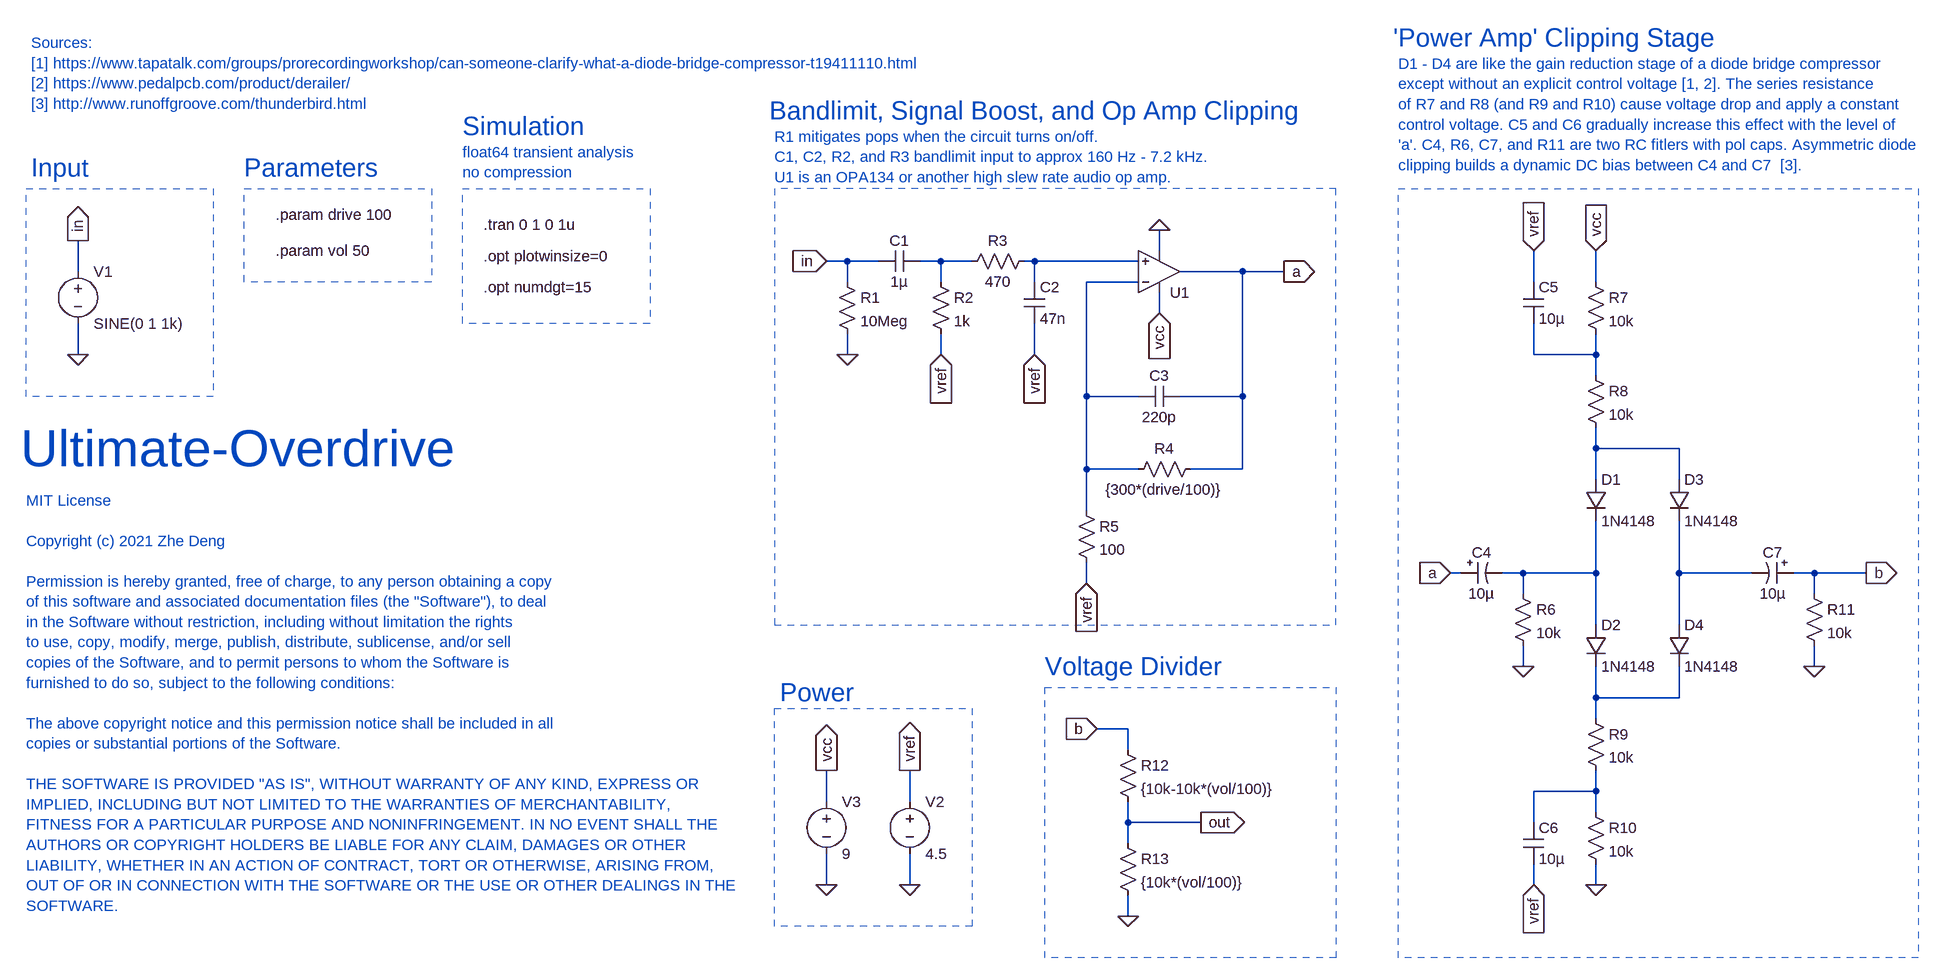
[diagram p0: schematic Ultimate-Overdrive.asc]
Ultimate-Overdrive.asc, the LTspice schematic file:
Version 4
SHEET 1 149556 120332
WIRE -427376 -275488 -427376 -275520
WIRE -427856 -275472 -427888 -275472
WIRE -427808 -275472 -427856 -275472
WIRE -427712 -275472 -427744 -275472
WIRE -427664 -275472 -427712 -275472
WIRE -427568 -275472 -427584 -275472
WIRE -427408 -275472 -427568 -275472
WIRE -429040 -275456 -429040 -275504
WIRE -427248 -275456 -427344 -275456
WIRE -427184 -275456 -427248 -275456
WIRE -427856 -275440 -427856 -275472
WIRE -427712 -275440 -427712 -275472
WIRE -427568 -275440 -427568 -275472
WIRE -427408 -275440 -427488 -275440
WIRE -426800 -275440 -426800 -275488
WIRE -426704 -275440 -426704 -275488
WIRE -427376 -275392 -427376 -275424
WIRE -429040 -275328 -429040 -275376
WIRE -427856 -275328 -427856 -275360
WIRE -427712 -275328 -427712 -275360
WIRE -427568 -275328 -427568 -275376
WIRE -426800 -275328 -426800 -275376
WIRE -426704 -275328 -426704 -275360
WIRE -426704 -275328 -426800 -275328
WIRE -426704 -275296 -426704 -275328
WIRE -427488 -275264 -427488 -275440
WIRE -427408 -275264 -427488 -275264
WIRE -427248 -275264 -427248 -275456
WIRE -427248 -275264 -427344 -275264
WIRE -426704 -275184 -426704 -275216
WIRE -426576 -275184 -426704 -275184
WIRE -427488 -275152 -427488 -275264
WIRE -427408 -275152 -427488 -275152
WIRE -427248 -275152 -427248 -275264
WIRE -427248 -275152 -427328 -275152
WIRE -426704 -275136 -426704 -275184
WIRE -426576 -275136 -426576 -275184
WIRE -427488 -275088 -427488 -275152
WIRE -426912 -274992 -426928 -274992
WIRE -426816 -274992 -426848 -274992
WIRE -426704 -274992 -426704 -275072
WIRE -426704 -274992 -426816 -274992
WIRE -426576 -274992 -426576 -275072
WIRE -426464 -274992 -426576 -274992
WIRE -426368 -274992 -426400 -274992
WIRE -426288 -274992 -426368 -274992
WIRE -427488 -274976 -427488 -275008
WIRE -426816 -274960 -426816 -274992
WIRE -426368 -274960 -426368 -274992
WIRE -426704 -274912 -426704 -274992
WIRE -426576 -274912 -426576 -274992
WIRE -426816 -274848 -426816 -274880
WIRE -426368 -274848 -426368 -274880
WIRE -426704 -274800 -426704 -274848
WIRE -426576 -274800 -426576 -274848
WIRE -426576 -274800 -426704 -274800
WIRE -426704 -274768 -426704 -274800
WIRE -427424 -274752 -427472 -274752
WIRE -427424 -274720 -427424 -274752
WIRE -426704 -274656 -426704 -274688
WIRE -426704 -274656 -426800 -274656
WIRE -427888 -274640 -427888 -274688
WIRE -427760 -274640 -427760 -274688
WIRE -426704 -274624 -426704 -274656
WIRE -427424 -274608 -427424 -274640
WIRE -427312 -274608 -427424 -274608
WIRE -426800 -274608 -426800 -274656
WIRE -427424 -274576 -427424 -274608
WIRE -427888 -274512 -427888 -274560
WIRE -427760 -274512 -427760 -274560
WIRE -426800 -274512 -426800 -274544
WIRE -426704 -274512 -426704 -274544
WIRE -427424 -274464 -427424 -274496
FLAG -427888 -275472 in
IOPIN -427888 -275472 In
FLAG -427376 -275520 0
FLAG -427376 -275392 vcc
IOPIN -427376 -275392 In
FLAG -427568 -275328 vref
IOPIN -427568 -275328 In
FLAG -427712 -275328 vref
IOPIN -427712 -275328 In
FLAG -427856 -275328 0
FLAG -427184 -275456 a
IOPIN -427184 -275456 Out
FLAG -426928 -274992 a
IOPIN -426928 -274992 In
FLAG -426704 -275488 vcc
IOPIN -426704 -275488 In
FLAG -426704 -274512 0
FLAG -426800 -274512 vref
IOPIN -426800 -274512 In
FLAG -426288 -274992 b
IOPIN -426288 -274992 Out
FLAG -426800 -275488 vref
IOPIN -426800 -275488 In
FLAG -426368 -274848 0
FLAG -426816 -274848 0
FLAG -427312 -274608 out
IOPIN -427312 -274608 Out
FLAG -427472 -274752 b
IOPIN -427472 -274752 In
FLAG -427424 -274464 0
FLAG -427888 -274512 0
FLAG -427760 -274512 0
FLAG -427888 -274688 vcc
IOPIN -427888 -274688 Out
FLAG -427760 -274688 vref
IOPIN -427760 -274688 Out
FLAG -429040 -275328 0
FLAG -429040 -275504 in
IOPIN -429040 -275504 Out
FLAG -427488 -274976 vref
IOPIN -427488 -274976 In
SYMBOL res -427872 -275456 R0
SYMATTR InstName R1
SYMATTR Value 10Meg
SYMBOL cap -427744 -275488 R90
WINDOW 0 0 32 VBottom 2
WINDOW 3 32 32 VTop 2
SYMATTR InstName C1
SYMATTR Value 1µ
SYMBOL cap -427584 -275440 R0
SYMATTR InstName C2
SYMATTR Value 47n
SYMBOL res -427728 -275456 R0
SYMATTR InstName R2
SYMATTR Value 1k
SYMBOL res -427568 -275488 R90
WINDOW 0 0 56 VBottom 2
WINDOW 3 32 56 VTop 2
SYMATTR InstName R3
SYMATTR Value 470
SYMBOL cap -427344 -275280 R90
WINDOW 0 0 32 VBottom 2
WINDOW 3 32 32 VTop 2
SYMATTR InstName C3
SYMATTR Value 220p
SYMBOL res -427312 -275168 R90
WINDOW 0 0 56 VBottom 2
WINDOW 3 32 56 VTop 2
SYMATTR InstName R4
SYMATTR Value {300*(drive/100)}
SYMBOL res -427504 -275104 R0
SYMATTR InstName R5
SYMATTR Value 100
SYMBOL diode -426720 -275136 R0
SYMATTR InstName D1
SYMATTR Value 1N4148
SYMBOL diode -426720 -274912 R0
SYMATTR InstName D2
SYMATTR Value 1N4148
SYMBOL diode -426592 -275136 R0
SYMATTR InstName D3
SYMATTR Value 1N4148
SYMBOL diode -426592 -274912 R0
SYMATTR InstName D4
SYMATTR Value 1N4148
SYMBOL polcap -426912 -275008 M90
WINDOW 0 0 32 VBottom 2
WINDOW 3 32 32 VTop 2
SYMATTR InstName C4
SYMATTR Value 10µ
SYMBOL res -426832 -274976 R0
SYMATTR InstName R6
SYMATTR Value 10k
SYMBOL res -426720 -275456 R0
SYMATTR InstName R7
SYMATTR Value 10k
SYMBOL res -426720 -275312 R0
SYMATTR InstName R8
SYMATTR Value 10k
SYMBOL res -426720 -274784 R0
SYMATTR InstName R9
SYMATTR Value 10k
SYMBOL res -426720 -274640 R0
SYMATTR InstName R10
SYMATTR Value 10k
SYMBOL cap -426816 -275440 R0
SYMATTR InstName C5
SYMATTR Value 10µ
SYMBOL cap -426816 -274608 R0
SYMATTR InstName C6
SYMATTR Value 10µ
SYMBOL polcap -426400 -275008 R90
WINDOW 0 0 32 VBottom 2
WINDOW 3 32 32 VTop 2
SYMATTR InstName C7
SYMATTR Value 10µ
SYMBOL res -426384 -274976 R0
SYMATTR InstName R11
SYMATTR Value 10k
SYMBOL res -427440 -274736 R0
SYMATTR InstName R12
SYMATTR Value {10k-10k*(vol/100)}
SYMBOL res -427440 -274592 R0
SYMATTR InstName R13
SYMATTR Value {10k*(vol/100)}
SYMBOL voltage -427888 -274656 R0
SYMATTR InstName V3
SYMATTR Value 9
SYMBOL voltage -427760 -274656 R0
SYMATTR InstName V2
SYMATTR Value 4.5
SYMBOL voltage -429040 -275472 R0
WINDOW 123 0 0 Left 0
WINDOW 39 0 0 Left 0
SYMATTR InstName V1
SYMATTR Value SINE(0 1 1k)
SYMBOL OpAmps\\UniversalOpamp2 -427376 -275456 M180
SYMATTR InstName U1
TEXT -428736 -275544 Left 2 !.param drive 100
TEXT -428736 -275488 Left 2 !.param vol 50
TEXT -428416 -275528 Left 2 !.tran 0 1 0 1u
TEXT -428416 -275480 Left 2 !.opt plotwinsize=0
TEXT -428416 -275432 Left 2 !.opt numdgt=15
TEXT -428784 -275616 Left 4 ;Parameters
TEXT -428448 -275680 Left 4 ;Simulation
TEXT -427960 -274808 Left 4 ;Power
TEXT -427976 -275704 Left 4 ;Bandlimit, Signal Boost, and Op Amp Clipping
TEXT -427552 -274848 Left 4 ;Voltage Divider
TEXT -427016 -275816 Left 4 ;'Power Amp' Clipping Stage
TEXT -429128 -275184 Left 6 ;Ultimate-Overdrive
TEXT -429120 -275104 Left 2 ;MIT License\n \nCopyright (c) 2021 Zhe Deng\n \nPermission is hereby granted, free of charge, to any person obtaining a copy\nof this software and associated documentation files (the "Software"), to deal\nin the Software without restriction, including without limitation the rights\nto use, copy, modify, merge, publish, distribute, sublicense, and/or sell\ncopies of the Software, and to permit persons to whom the Software is\nfurnished to do so, subject to the following conditions:\n \nThe above copyright notice and this permission notice shall be included in all\ncopies or substantial portions of the Software.\n \nTHE SOFTWARE IS PROVIDED "AS IS", WITHOUT WARRANTY OF ANY KIND, EXPRESS OR\nIMPLIED, INCLUDING BUT NOT LIMITED TO THE WARRANTIES OF MERCHANTABILITY,\nFITNESS FOR A PARTICULAR PURPOSE AND NONINFRINGEMENT. IN NO EVENT SHALL THE\nAUTHORS OR COPYRIGHT HOLDERS BE LIABLE FOR ANY CLAIM, DAMAGES OR OTHER\nLIABILITY, WHETHER IN AN ACTION OF CONTRACT, TORT OR OTHERWISE, ARISING FROM,\nOUT OF OR IN CONNECTION WITH THE SOFTWARE OR THE USE OR OTHER DEALINGS IN THE\nSOFTWARE.
TEXT -429112 -275616 Left 4 ;Input
TEXT -427968 -275664 Left 2 ;R1 mitigates pops when the circuit turns on/off.\nC1, C2, R2, and R3 bandlimit input to approx 160 Hz - 7.2 kHz.  \nU1 is an OPA134 or another high slew rate audio op amp.
TEXT -427008 -275776 Left 2 ;D1 - D4 are like the gain reduction stage of a diode bridge compressor \nexcept without an explicit control voltage [1, 2]. The series resistance \nof R7 and R8 (and R9 and R10) cause voltage drop and apply a constant \ncontrol voltage. C5 and C6 gradually increase this effect with the level of \n'a'. C4, R6, C7, and R11 are two RC fitlers with pol caps. Asymmetric diode \nclipping builds a dynamic DC bias between C4 and C7  [3].
TEXT -428448 -275640 Left 2 ;float64 transient analysis\nno compression
TEXT -429112 -275808 Left 2 ;Sources:\n[1] https://www.tapatalk.com/groups/prorecordingworkshop/can-someone-clarify-what-a-diode-bridge-compressor-t19411110.html\n[2] https://www.pedalpcb.com/product/derailer/\n[3] http://www.runoffgroove.com/thunderbird.html
RECTANGLE Normal -427968 -274912 -427104 -275584 2
RECTANGLE Normal -427104 -274400 -427552 -274816 2
RECTANGLE Normal -428160 -275376 -428448 -275584 2
RECTANGLE Normal -428496 -275440 -428784 -275584 2
RECTANGLE Normal -427664 -274448 -427968 -274784 2
RECTANGLE Normal -426208 -274400 -427008 -275584 2
RECTANGLE Normal -429120 -275584 -428832 -275264 2

The netlist it stands for:
* Ultimate-Overdrive.asc
R1 in 0 10Meg
C1 N001 in 1µ
C2 N002 vref 47n
R2 N001 vref 1k
R3 N002 N001 470
C3 a N003 220p
R4 a N003 {300*(drive/100)}
R5 N003 vref 100
D1 N005 N006 1N4148
D2 N006 N008 1N4148
D3 N005 N007 1N4148
D4 N007 N008 1N4148
C4 a N006 10µ
R6 N006 0 10k
R7 vcc N004 10k
R8 N004 N005 10k
R9 N008 N009 10k
R10 N009 0 10k
C5 vref N004 10µ
C6 N009 vref 10µ
C7 b N007 10µ
R11 b 0 10k
R12 b out {10k-10k*(vol/100)}
R13 out 0 {10k*(vol/100)}
V3 vcc 0 9
V2 vref 0 4.5
V1 in 0 SINE(0 1 1k)
XU1 N002 N003 vcc 0 a level.2 Avol=1Meg GBW=10Meg Slew=10Meg ilimit=25m rail=0 Vos=0 phimargin=45 en=0 enk=0 in=0 ink=0 Rin=500Meg  ; pins IN+ IN- V+ V- OUT
.model D D
.lib standard.dio
.param drive 100
.param vol 50
.tran 0 1 0 1u
.opt plotwinsize=0
.opt numdgt=15
* Parameters
* Simulation
* Power
* Bandlimit, Signal Boost, and Op Amp Clipping
* Voltage Divider
* 'Power Amp' Clipping Stage
* Ultimate-Overdrive
* MIT License
* Copyright (c) 2021 Zhe Deng
* Permission is hereby granted, free of charge, to any person obtaining a copy
* of this software and associated documentation files (the "Software"), to deal
* in the Software without restriction, including without limitation the rights
* to use, copy, modify, merge, publish, distribute, sublicense, and/or sell
* copies of the Software, and to permit persons to whom the Software is
* furnished to do so, subject to the following conditions:
* The above copyright notice and this permission notice shall be included in all
* copies or substantial portions of the Software.
* THE SOFTWARE IS PROVIDED "AS IS", WITHOUT WARRANTY OF ANY KIND, EXPRESS OR
* IMPLIED, INCLUDING BUT NOT LIMITED TO THE WARRANTIES OF MERCHANTABILITY,
* FITNESS FOR A PARTICULAR PURPOSE AND NONINFRINGEMENT. IN NO EVENT SHALL THE
* AUTHORS OR COPYRIGHT HOLDERS BE LIABLE FOR ANY CLAIM, DAMAGES OR OTHER
* LIABILITY, WHETHER IN AN ACTION OF CONTRACT, TORT OR OTHERWISE, ARISING FROM,
* OUT OF OR IN CONNECTION WITH THE SOFTWARE OR THE USE OR OTHER DEALINGS IN THE
* SOFTWARE.
* Input
* R1 mitigates pops when the circuit turns on/off.
* C1, C2, R2, and R3 bandlimit input to approx 160 Hz - 7.2 kHz.
* U1 is an OPA134 or another high slew rate audio op amp.
* D1 - D4 are like the gain reduction stage of a diode bridge compressor
* except without an explicit control voltage [1, 2]. The series resistance
* of R7 and R8 (and R9 and R10) cause voltage drop and apply a constant
* control voltage. C5 and C6 gradually increase this effect with the level of
* 'a'. C4, R6, C7, and R11 are two RC fitlers with pol caps. Asymmetric diode
* clipping builds a dynamic DC bias between C4 and C7  [3].
* float64 transient analysis
* no compression
* Sources:
* [1] https://www.tapatalk.com/groups/prorecordingworkshop/can-someone-clarify-what-a-diode-bridge-compressor-t19411110.html
* [2] https://www.pedalpcb.com/product/derailer/
* [3] http://www.runoffgroove.com/thunderbird.html
.lib UniversalOpamps2.sub
.backanno
.end